# Altium schematic sheet STM32 Decoupling.SchDoc
size A4; SheetNumber: 4; SheetTotal: 7
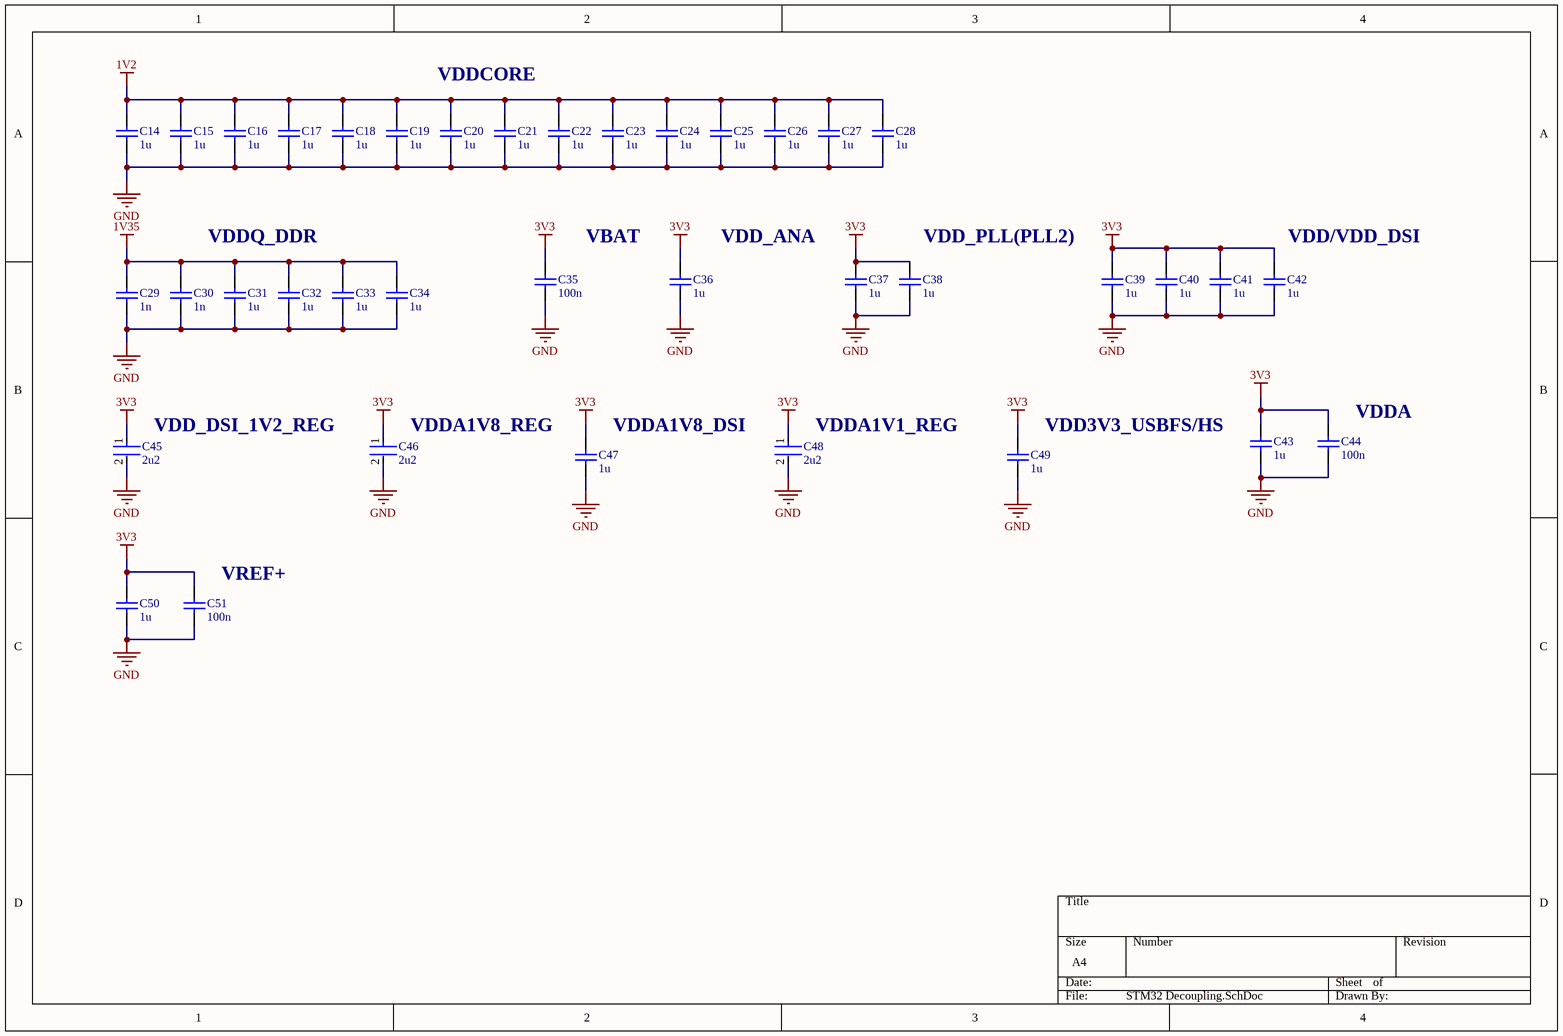
[diagram p0: STM32 Decoupling.SchDoc]

## Parts
C14  1u  [CAPC0603X33X15LL03T05]
C15  1u  [CAPC0603X33X15LL03T05]
C16  1u  [CAPC0603X33X15LL03T05]
C17  1u  [CAPC0603X33X15LL03T05]
C18  1u  [CAPC0603X33X15LL03T05]
C19  1u  [CAPC0603X33X15LL03T05]
C20  1u  [CAPC0603X33X15LL03T05]
C21  1u  [CAPC0603X33X15LL03T05]
C22  1u  [CAPC0603X33X15LL03T05]
C23  1u  [CAPC0603X33X15LL03T05]
C24  1u  [CAPC0603X33X15LL03T05]
C25  1u  [CAPC0603X33X15LL03T05]
C26  1u  [CAPC0603X33X15LL03T05]
C27  1u  [CAPC0603X33X15LL03T05]
C28  1u  [CAPC0603X33X15LL03T05]
C29  1n  [CAPC0603X33X15LL03T05]
C30  1n  [CAPC0603X33X15LL03T05]
C31  1u  [CAPC0603X33X15LL03T05]
C32  1u  [CAPC0603X33X15LL03T05]
C33  1u  [CAPC0603X33X15LL03T05]
C34  1u  [CAPC0603X33X15LL03T05]
C35  100n  [CAPC0603X33X15LL03T05]
C36  1u  [CAPC0603X33X15LL03T05]
C37  1u  [CAPC0603X33X15LL03T05]
C38  1u  [CAPC0603X33X15LL03T05]
C39  1u  [CAPC0603X33X15LL03T05]
C40  1u  [CAPC0603X33X15LL03T05]
C41  1u  [CAPC0603X33X15LL03T05]
C42  1u  [CAPC0603X33X15LL03T05]
C43  1u  [CAPC0603X33X15LL03T05]
C44  100n  [CAPC0603X33X15LL03T05]
C45  2u2  [FP-C0603C-CF-MFG]
C46  2u2  [FP-C0603C-CF-MFG]
C47  1u  [CAPC0603X33X15LL03T05]
C48  2u2  [FP-C0603C-CF-MFG]
C49  1u  [CAPC0603X33X15LL03T05]
C50  1u  [CAPC0603X33X15LL03T05]
C51  100n  [CAPC0603X33X15LL03T05]

## Nets
1V2: C14.2 C15.2 C16.2 C17.2 C18.2 C19.2 C20.2 C21.2 C22.2 C23.2 C24.2 C25.2 C26.2 C27.2 C28.2
1V35: C29.2 C30.2 C31.2 C32.2 C33.2 C34.2
3V3: C35.2 C36.2 C37.2 C38.2 C39.2 C40.2 C41.2 C42.2 C43.2 C44.2 C45.1 C46.1 C47.2 C48.1 C49.2 C50.2 C51.2
GND: C14.1 C15.1 C16.1 C17.1 C18.1 C19.1 C20.1 C21.1 C22.1 C23.1 C24.1 C25.1 C26.1 C27.1 C28.1 C29.1 C30.1 C31.1 C32.1 C33.1 C34.1 C35.1 C36.1 C37.1 C38.1 C39.1 C40.1 C41.1 C42.1 C43.1 C44.1 C45.2 C46.2 C47.1 C48.2 C49.1 C50.1 C51.1

## Notes on the sheet
- VDDCORE
- VDDQ_DDR
- VBAT
- VDD_ANA
- (near C38) VDD_PLL(PLL2)
- (near C42) VDD/VDD_DSI
- (near C45) VDD_DSI_1V2_REG
- (near C46) VDDA1V8_REG
- (near C47) VDDA1V8_DSI
- (near C48) VDDA1V1_REG
- (near C49) VDD3V3_USBFS/HS
- (near C44) VDDA
- (near C51) VREF+

## Library data of the parts
C14-C44 C47 C49-C51 = CMP-2010-00159-1: Part Number: 02016D104KAT2A; Manufacturer: AVX Interconnect / Elco
C45 C46 C48 = CMP-2006-03061-2: CAP CER 0.1UF 50V X7R 0603; Manufacturer: KEMET; Manufacturer Part Number: C0603C104K5RACTU; Tolerance: 0.1; Temperature Coefficient: 30ppm/°C; Material: Ceramic; Automotive Grade: Grade 1; Value: 0.10 μF; Temperature: -55°C to +125°C; RoHS: TRUE; Temperature Range High: +125°C; Lead Free: Yes; Octopart: https://octopart.com/c0603c104k5ractu-kemet-139244; Digikey Description: CAP CER 0.1UF 50V X7R 0603; Category: Cap; Package: C0603C-CF; ComponentLink2Description: Datasheet; Temperature Range Low: -55°C; Device Class L1: Passive Components; Voltage Rating: 50 V; Automotive: Yes; Device Class L3: Ceramic Capacitors; ComponentLink2URL: https://api.kemet.com/component-edge/download/datasheet/C0603C100J5GACAUTO.pdf; Capacitance: 0.10 μF; Device Class L2: Capacitors; Temperature Characteristic: X7R; Height: 0.87mm